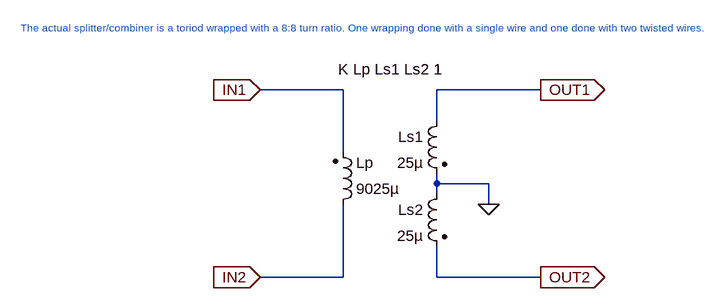
[diagram p0: schematic splitter_combiner.asc]
splitter_combiner.asc, the LTspice schematic file:
Version 4
SHEET 1 1036 680
WIRE 80 80 -48 80
WIRE 384 80 224 80
WIRE 224 128 224 80
WIRE 80 176 80 80
WIRE 224 224 224 208
WIRE 304 224 224 224
WIRE 224 240 224 224
WIRE 304 256 304 224
WIRE 80 368 80 256
WIRE 80 368 -48 368
WIRE 224 368 224 320
WIRE 384 368 224 368
FLAG 304 256 0
FLAG -48 80 IN1
IOPIN -48 80 In
FLAG -48 368 IN2
IOPIN -48 368 In
FLAG 384 80 OUT1
IOPIN 384 80 Out
FLAG 384 368 OUT2
IOPIN 384 368 Out
SYMBOL ind2 64 272 M180
WINDOW 0 36 80 Left 2
WINDOW 3 36 40 Left 2
SYMATTR InstName Lp
SYMATTR Value 9025µ
SYMATTR Type ind
SYMBOL ind2 240 112 M0
SYMATTR InstName Ls1
SYMATTR Value 25µ
SYMATTR Type ind
SYMBOL ind2 240 224 M0
SYMATTR InstName Ls2
SYMATTR Value 25µ
SYMATTR Type ind
TEXT 72 48 Left 2 !K Lp Ls1 Ls2 1
TEXT -416 -16 Left 1 ;The actual splitter/combiner is a toriod wrapped with a 8:8 turn ratio. One wrapping done with a single wire and one done with two twisted wires.

The netlist it stands for:
* splitter_combiner.asc
Lp IN2 IN1 9025µ
Ls1 OUT1 0 25µ
Ls2 0 OUT2 25µ
K Lp Ls1 Ls2 1
* The actual splitter/combiner is a toriod wrapped with a 8:8 turn ratio. One wrapping done with a single wire and one done with two twisted wires.
.backanno
.end